# EasyEDA schematic SCH_电池电压检测模块_2022-06-13.json
TITLE: Sheet_1; REV: 1.0; Date: 2021-11-11; Sheet: 1/1; Drawn By: amlzhuy; Company: Your Company
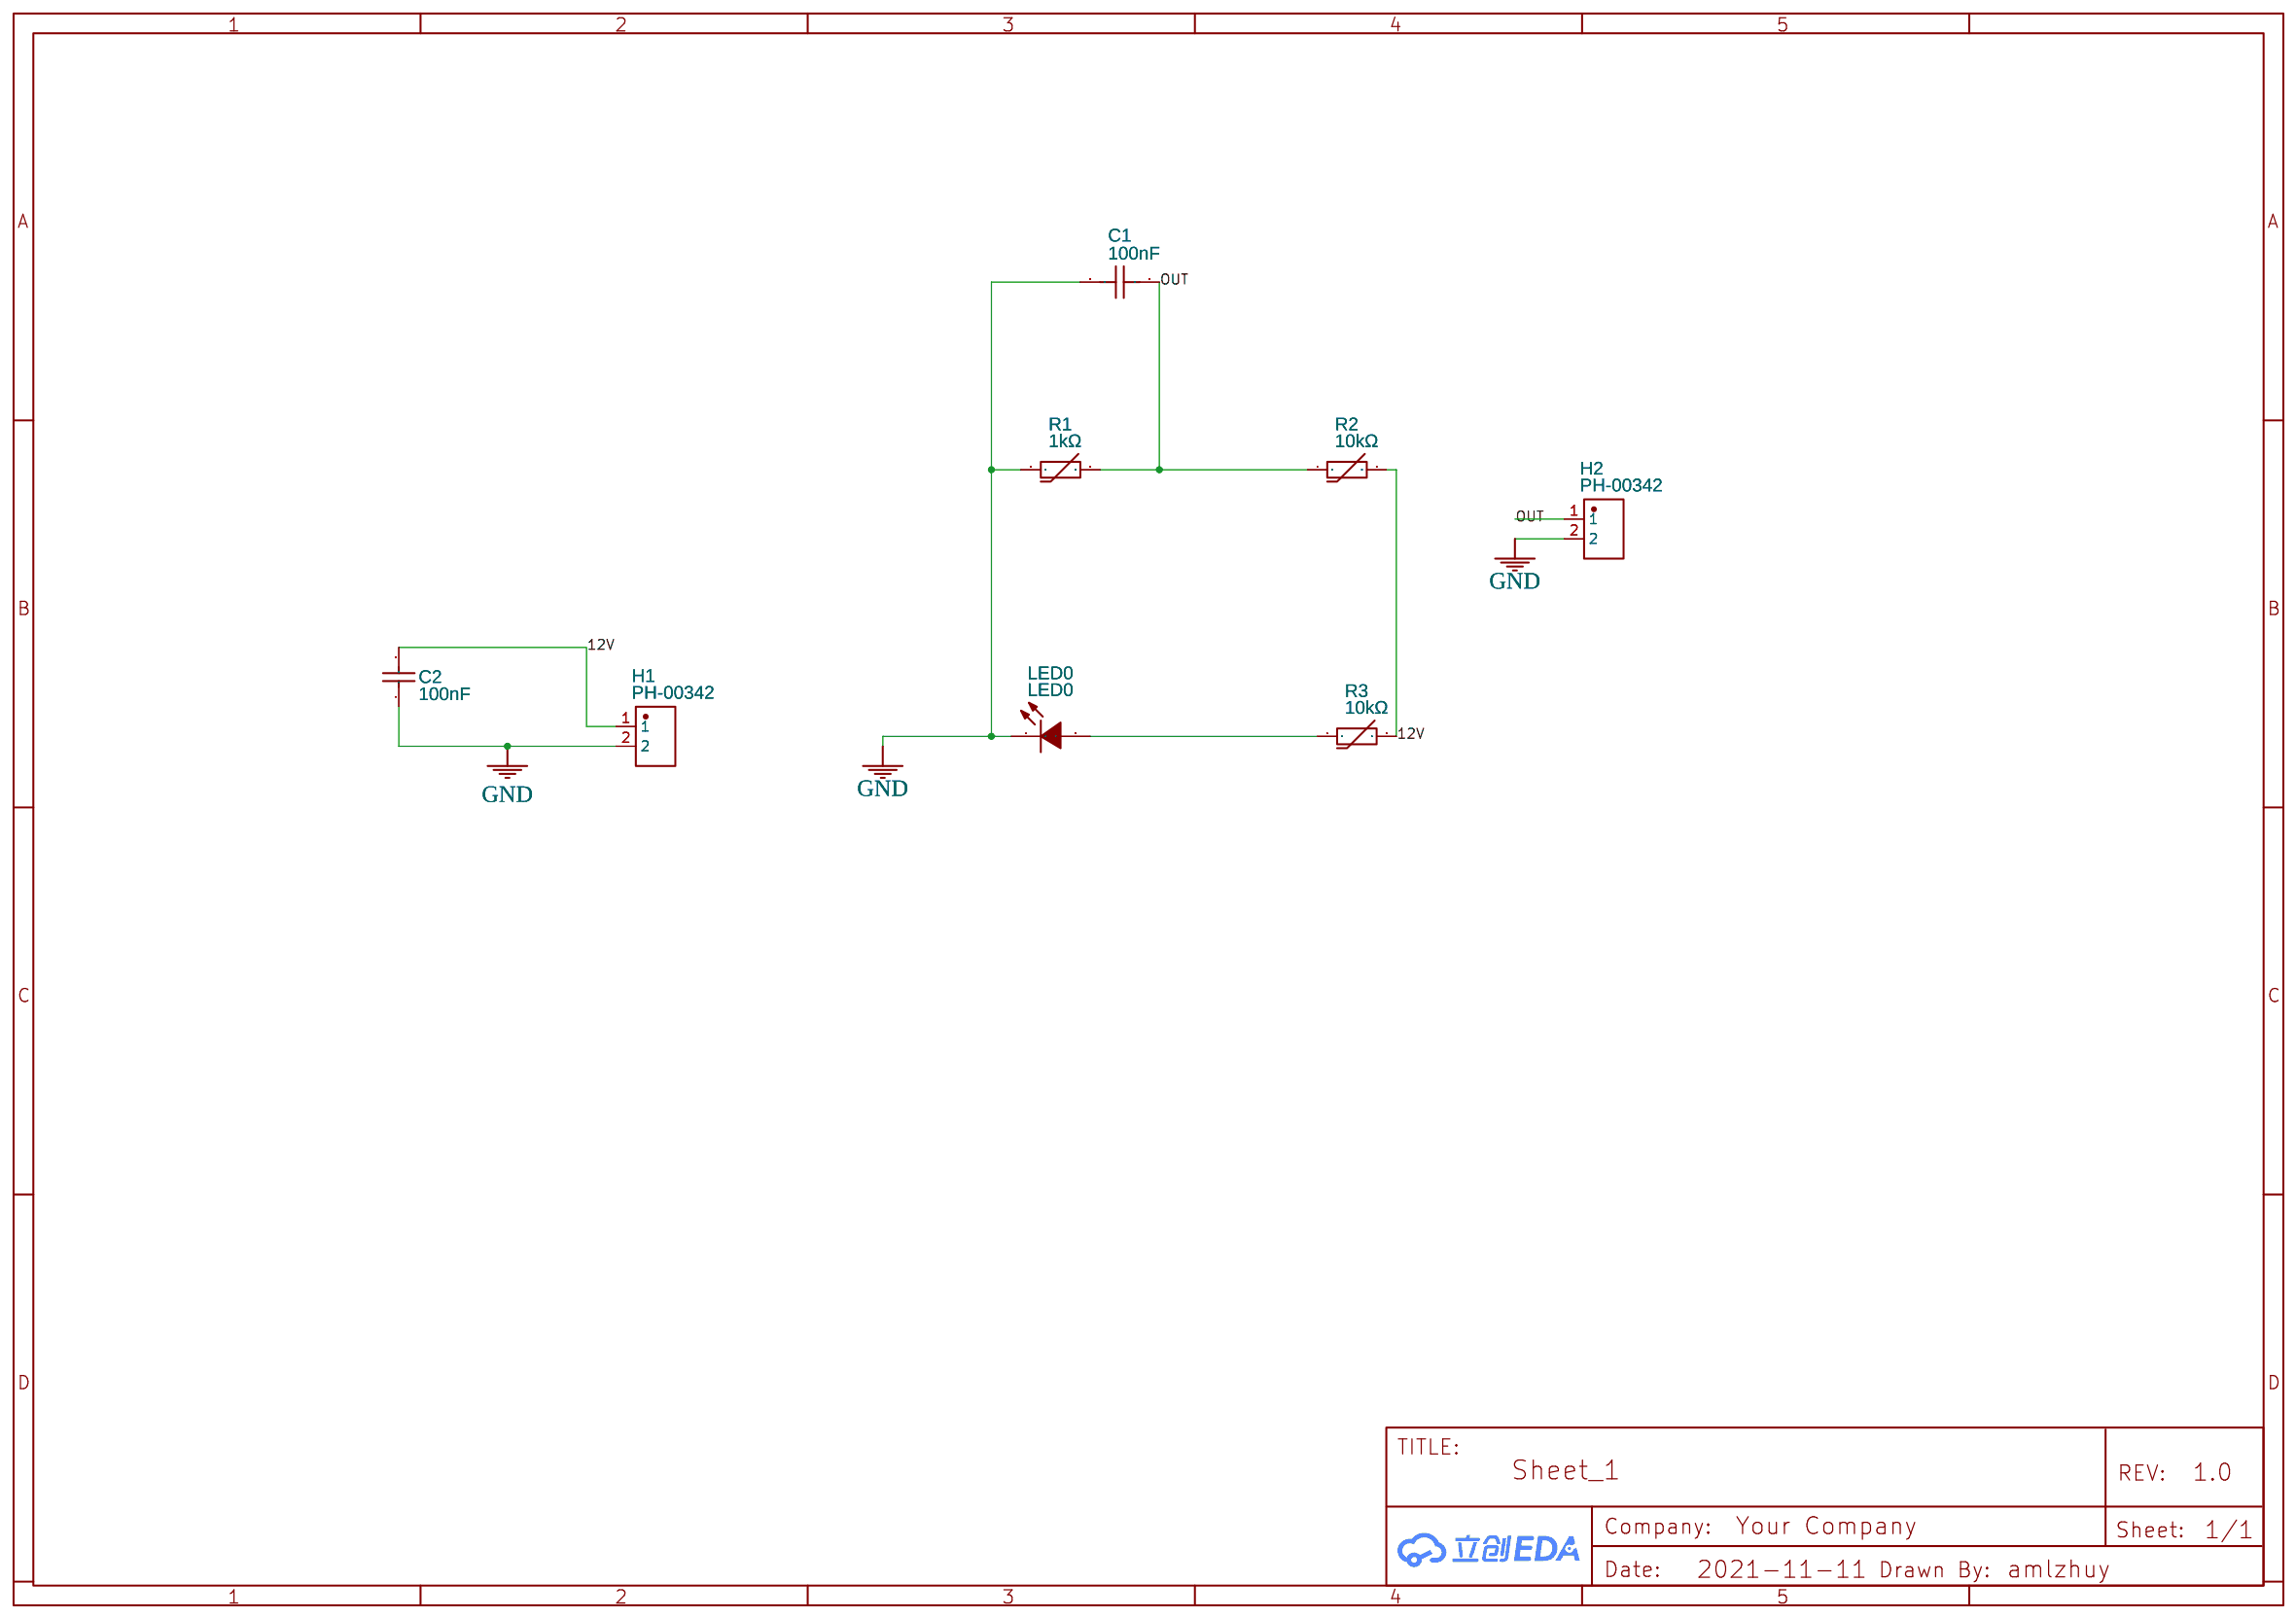
[diagram p0: schematic sheet]

## Parts
C1  100nF  [C0603]
C2  100nF  [C0603]
H1  PH-00342  [HDR-TH_2P-P2.54-V-M]
H2  PH-00342  [HDR-TH_2P-P2.54-V-M]
LED0  LED0  [LED0603-RD]
R1  1kΩ  [R0603]
R2  10kΩ  [R0603]
R3  10kΩ  [R0603]

## Library data of the parts
C1 = CL10B104KB8NNNC: Supplier: LCSC; Manufacturer: SAMSUNG; Supplier Part: C1591; JLCPCB Part Class: Extended Part
C2 = CL10B104JB8NNNC: Supplier: LCSC; Manufacturer: SAMSUNG; Supplier Part: C24452; JLCPCB Part Class: Extended Part
H1 H2 = PH-00342: Supplier: LCSC; Supplier Part: C2685154; Manufacturer: Liansheng(连盛); Contributor: LCSC
LED0 = FC-1608UGK-520D: Supplier: LCSC; Manufacturer: NATIONSTAR; Supplier Part: C87326; JLCPCB Part Class: Extended Part
R1-R3 = SDNT1608X103J3450HTF: Supplier: LCSC; Manufacturer: Sunlord; Supplier Part: C43113

## Nets
12V: C2.2 H1.1 R2.2 R3.2
GND: C1.1 C2.1 H1.2 H2.2 LED0.1(K) R1.1
OUT: C1.2 H2.1 R1.2 R2.1
Net-(LED0-2): LED0.2(A) R3.1
